# EAGLE design LE910_breakout_0 (EAGLE 7.7.0)
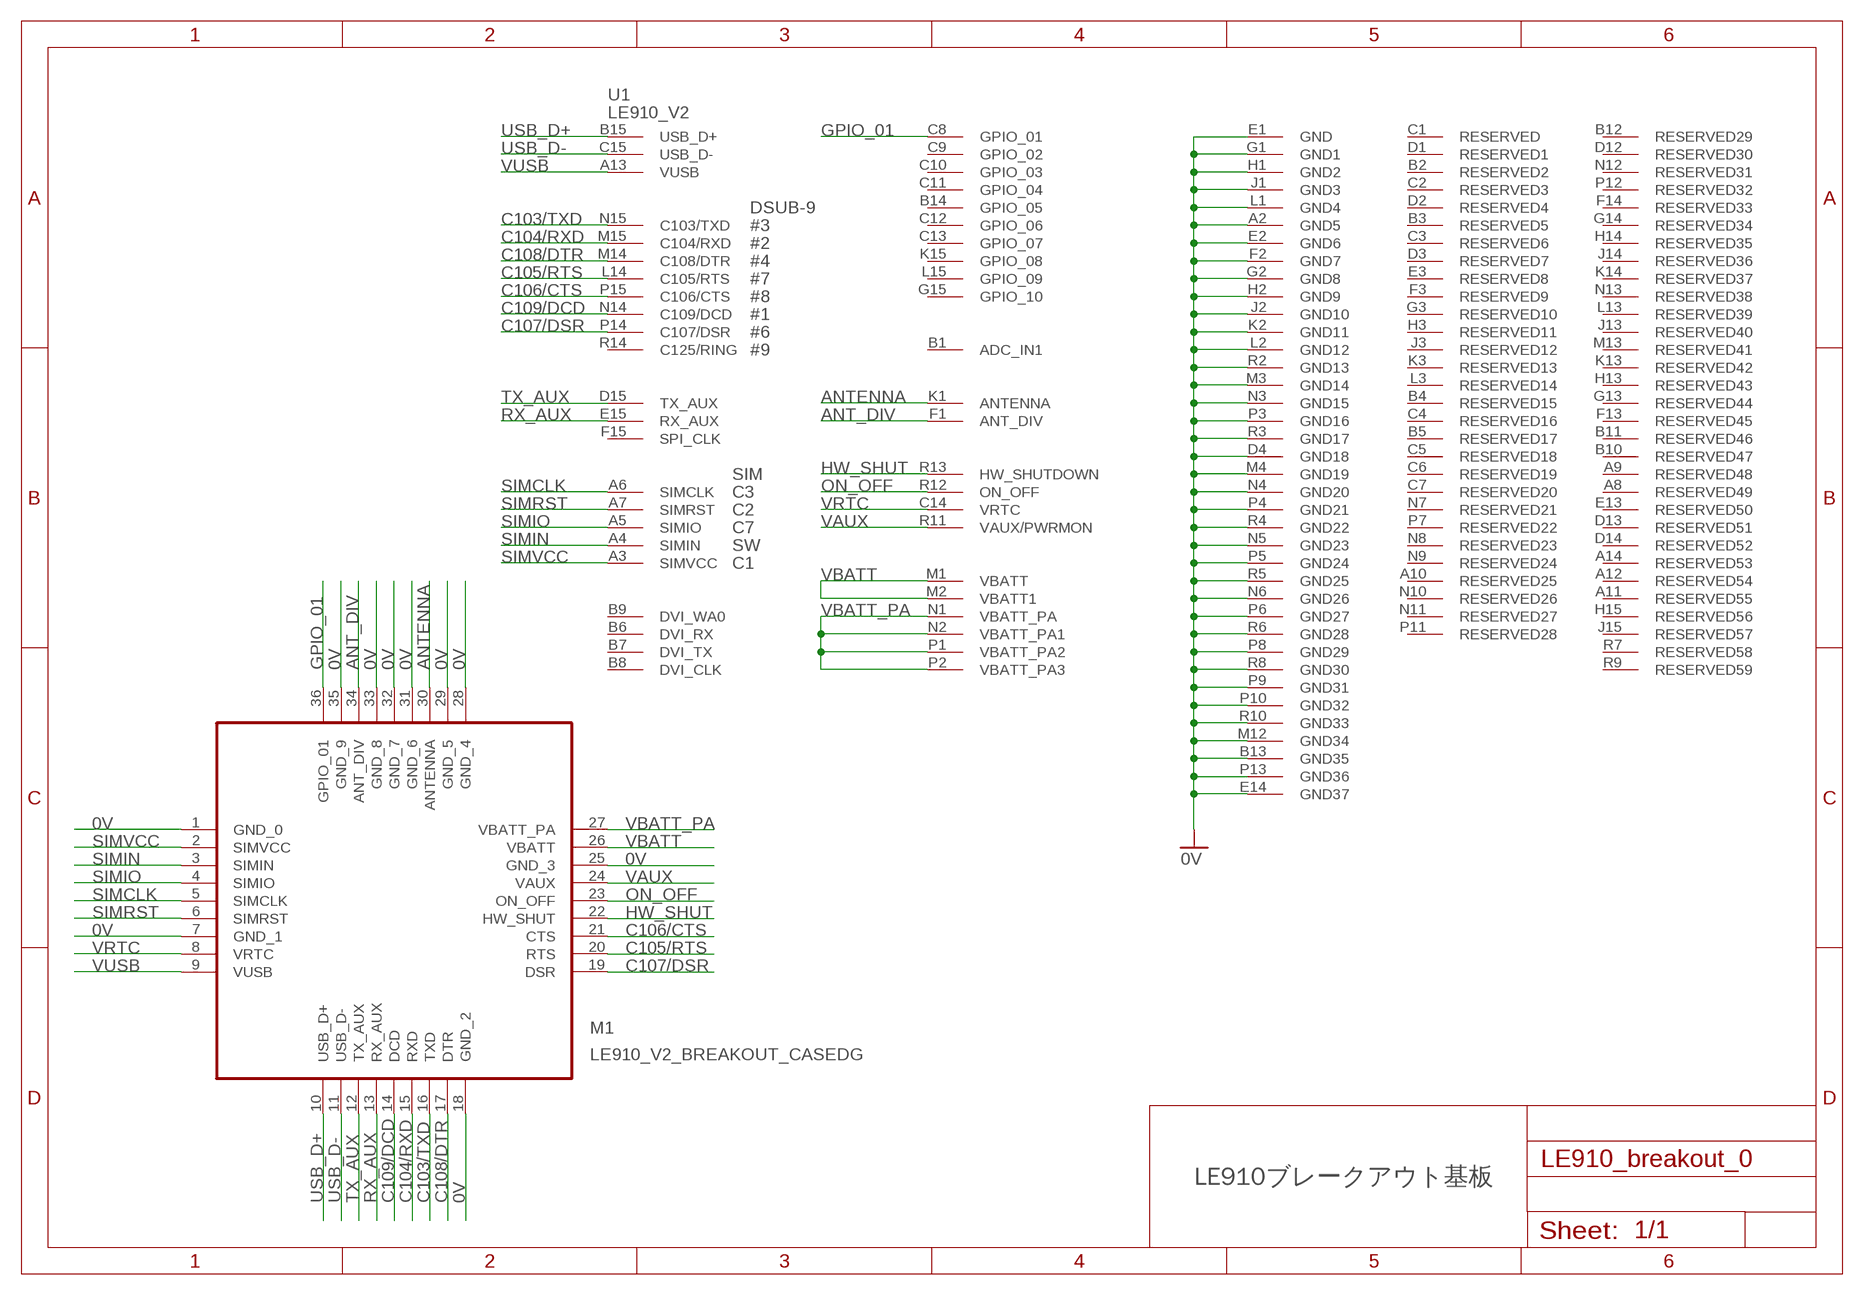
[diagram p0: schematic, sheet 1]

## Parts
M1  LE910_V2_BREAKOUT_CASEDG  [LE910_V2_BREAKOUT_CASEDG]
U1  LE910_V2  [LE910_V2]

## Nets
0V: M1.1(GND_0) M1.7(GND_1) M1.18(GND_2) M1.25(GND_3) M1.28(GND_4) M1.29(GND_5) M1.31(GND_6) M1.32(GND_7) M1.33(GND_8) M1.35(GND_9) U1.A2(GND5) U1.B13(GND35) U1.D4(GND18) U1.E1(GND) U1.E2(GND6) U1.E14(GND37) U1.F2(GND7) U1.G1(GND1) U1.G2(GND8) U1.H1(GND2) U1.H2(GND9) U1.J1(GND3) U1.J2(GND10) U1.K2(GND11) U1.L1(GND4) U1.L2(GND12) U1.M3(GND14) U1.M4(GND19) U1.M12(GND34) U1.N3(GND15) U1.N4(GND20) U1.N5(GND23) U1.N6(GND26) U1.P3(GND16) U1.P4(GND21) U1.P5(GND24) U1.P6(GND27) U1.P8(GND29) U1.P9(GND31) U1.P10(GND32) U1.P13(GND36) U1.R2(GND13) U1.R3(GND17) U1.R4(GND22) U1.R5(GND25) U1.R6(GND28) U1.R8(GND30) U1.R10(GND33)
ANT_DIV: M1.34(ANT_DIV) U1.F1(ANT_DIV)
ANTENNA: M1.30(ANTENNA) U1.K1(ANTENNA)
C103/TXD: M1.16(TXD) U1.N15(C103/TXD)
C104/RXD: M1.15(RXD) U1.M15(C104/RXD)
C105/RTS: M1.20(RTS) U1.L14(C105/RTS)
C106/CTS: M1.21(CTS) U1.P15(C106/CTS)
C107/DSR: M1.19(DSR) U1.P14(C107/DSR)
C108/DTR: M1.17(DTR) U1.M14(C108/DTR)
C109/DCD: M1.14(DCD) U1.N14(C109/DCD)
GPIO_01: M1.36(GPIO_01) U1.C8(GPIO_01)
HW_SHUT: M1.22(HW_SHUT) U1.R13(HW_SHUTDOWN)
ON_OFF: M1.23(ON_OFF) U1.R12(ON_OFF)
RX_AUX: M1.13(RX_AUX) U1.E15(RX_AUX)
SIMCLK: M1.5(SIMCLK) U1.A6(SIMCLK)
SIMIN: M1.3(SIMIN) U1.A4(SIMIN)
SIMIO: M1.4(SIMIO) U1.A5(SIMIO)
SIMRST: M1.6(SIMRST) U1.A7(SIMRST)
SIMVCC: M1.2(SIMVCC) U1.A3(SIMVCC)
TX_AUX: M1.12(TX_AUX) U1.D15(TX_AUX)
USB_D+: M1.10(USB_D+) U1.B15(USB_D+)
USB_D-: M1.11(USB_D-) U1.C15(USB_D-)
VAUX: M1.24(VAUX) U1.R11(VAUX/PWRMON)
VBATT: M1.26(VBATT) U1.M1(VBATT) U1.M2(VBATT1)
VBATT_PA: M1.27(VBATT_PA) U1.N1(VBATT_PA) U1.N2(VBATT_PA1) U1.P1(VBATT_PA2) U1.P2(VBATT_PA3)
VRTC: M1.8(VRTC) U1.C14(VRTC)
VUSB: M1.9(VUSB) U1.A13(VUSB)
Unconnected: U1.A8(RESERVED49) U1.A9(RESERVED48) U1.A10(RESERVED25) U1.A11(RESERVED55) U1.A12(RESERVED54) U1.A14(RESERVED53) U1.B1(ADC_IN1) U1.B2(RESERVED2) U1.B3(RESERVED5) U1.B4(RESERVED15) U1.B5(RESERVED17) U1.B6(DVI_RX) U1.B7(DVI_TX) U1.B8(DVI_CLK) U1.B9(DVI_WA0) U1.B10(RESERVED47) U1.B11(RESERVED46) U1.B12(RESERVED29) U1.B14(GPIO_05) U1.C1(RESERVED) U1.C2(RESERVED3) U1.C3(RESERVED6) U1.C4(RESERVED16) U1.C5(RESERVED18) U1.C6(RESERVED19) U1.C7(RESERVED20) U1.C9(GPIO_02) U1.C10(GPIO_03) U1.C11(GPIO_04) U1.C12(GPIO_06) U1.C13(GPIO_07) U1.D1(RESERVED1) U1.D2(RESERVED4) U1.D3(RESERVED7) U1.D12(RESERVED30) U1.D13(RESERVED51) U1.D14(RESERVED52) U1.E3(RESERVED8) U1.E13(RESERVED50) U1.F3(RESERVED9) U1.F13(RESERVED45) U1.F14(RESERVED33) U1.F15(SPI_CLK) U1.G3(RESERVED10) U1.G13(RESERVED44) U1.G14(RESERVED34) U1.G15(GPIO_10) U1.H3(RESERVED11) U1.H13(RESERVED43) U1.H14(RESERVED35) U1.H15(RESERVED56) U1.J3(RESERVED12) U1.J13(RESERVED40) U1.J14(RESERVED36) U1.J15(RESERVED57) U1.K3(RESERVED13) U1.K13(RESERVED42) U1.K14(RESERVED37) U1.K15(GPIO_08) U1.L3(RESERVED14) U1.L13(RESERVED39) U1.L15(GPIO_09) U1.M13(RESERVED41) U1.N7(RESERVED21) U1.N8(RESERVED23) U1.N9(RESERVED24) U1.N10(RESERVED26) U1.N11(RESERVED27) U1.N12(RESERVED31) U1.N13(RESERVED38) U1.P7(RESERVED22) U1.P11(RESERVED28) U1.P12(RESERVED32) U1.R7(RESERVED58) U1.R9(RESERVED59) U1.R14(C125/RING)

## Notes on the sheet
- DSUB-9
- #3
- #2
- #4
- #7
- #8
- #1
- #6
- #9
- SIM
- C3
- C2
- C7
- SW
- C1
- LE910ブレークアウト基板

## Library data of the parts
M1 = Modules:LE910_V2_BREAKOUT: LE910-V2ブレークアウト基板 最小構成用インターフェース
U1 = Modules:LE910_V2: Cellular module

## Board
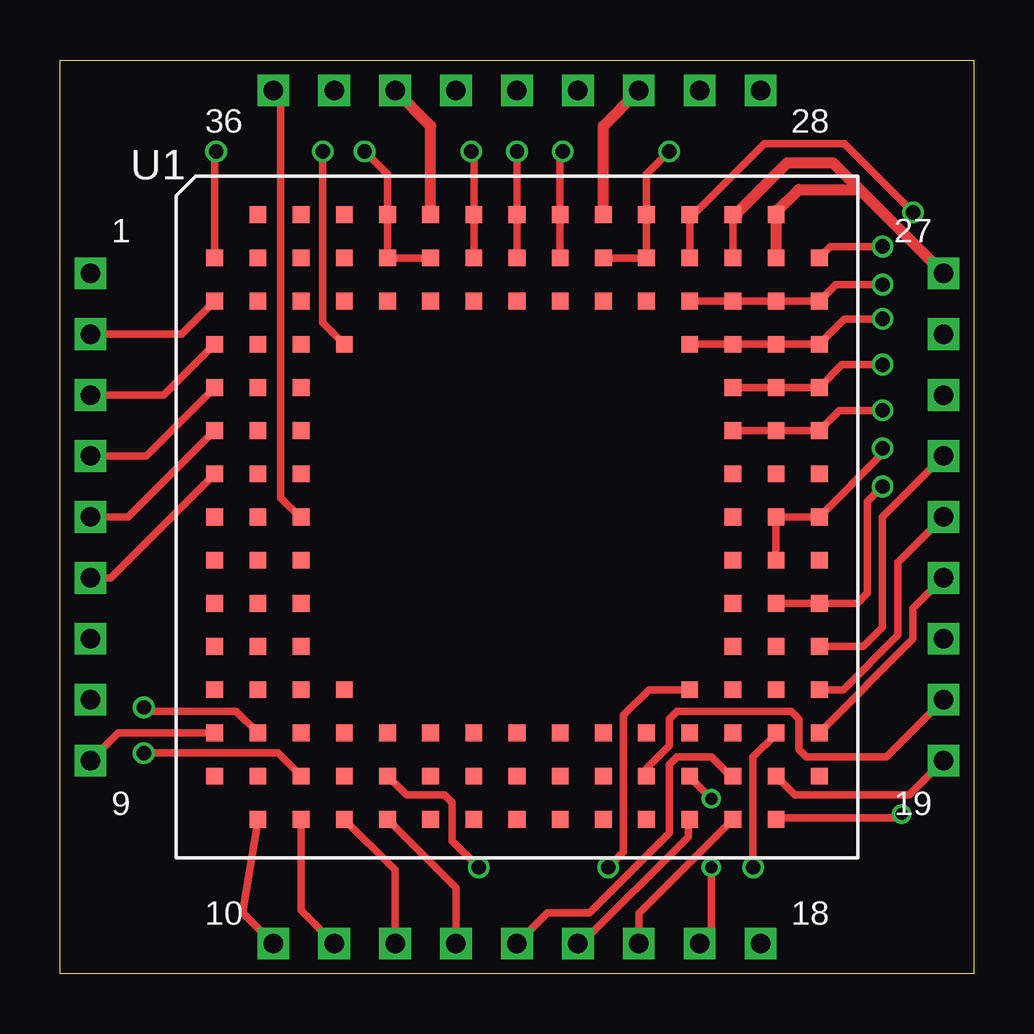
[diagram p1: board, top side]
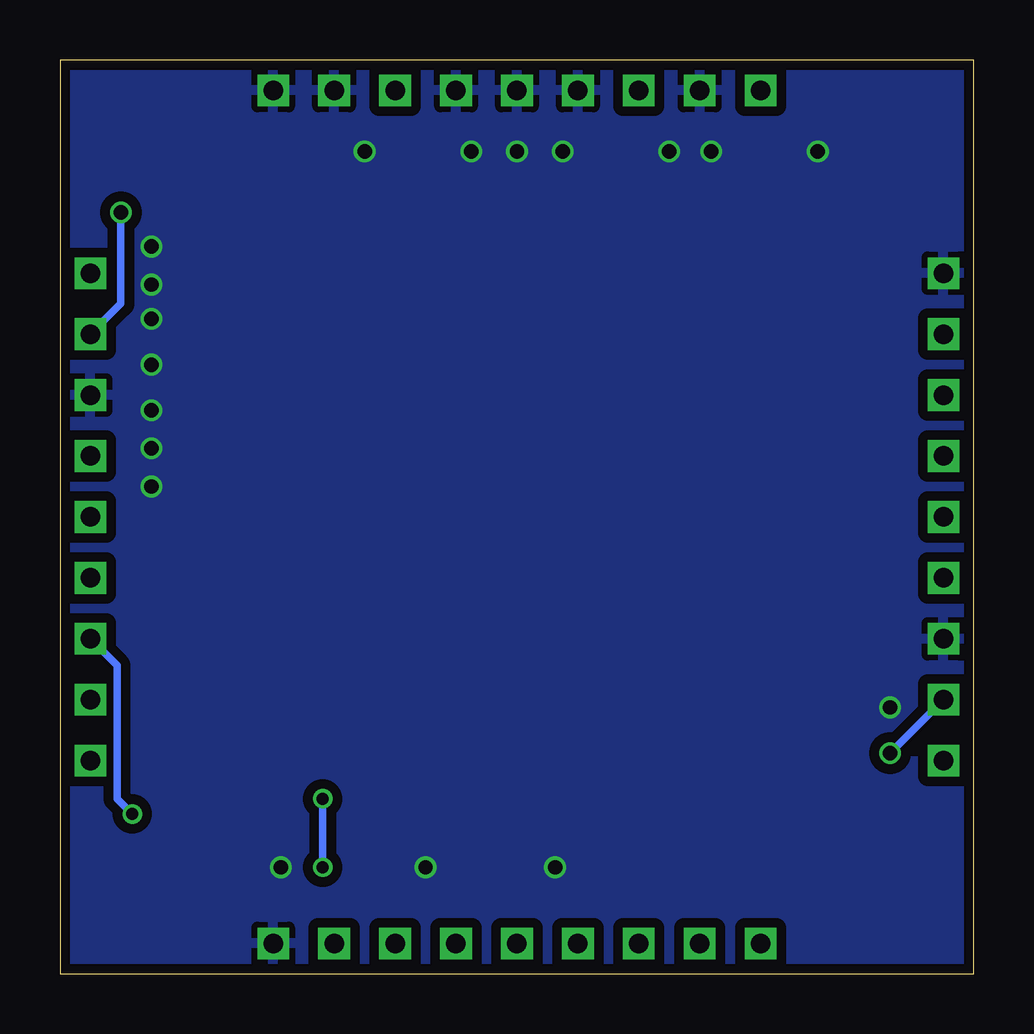
[diagram p2: board, bottom side, seen from below]

Size 38.1 x 38.1 mm. Coordinates in mm from the lower left corner, seen from the top.
Outline: 0,0 0,38.1 38.1,38.1 38.1,0 0,0
Copper layers (1*16): Top 0.035mm / dielectric 1.5mm / Bottom 0.035mm
Design rules "SeeedStudio_2layer_DRU_no_angle_20140221": minimum track width 6mil, minimum drill 12mil, track to track 6mil, track to pad 6mil, pad to pad 6mil, via to via 6mil, smd to smd 0mil, copper to edge 10mil, drill to drill 10mil, minimum pad ring 10mil, minimum via ring 6mil, stop-mask expansion 2mil, vias tented up to drill 100mil, thermal gap 10mil

### Footprints (pad centres in the part's own frame; a part is rotated, then mirrored left to right if it is on the bottom)
LE910_V2_BREAKOUT_CASEDG = drill 0.813 pad 1.27 square: 1 0,27.94; 2 0,25.4; 3 0,22.86; 4 0,20.32; 5 0,17.78; 6 0,15.24; 7 0,12.7; 8 0,10.16; 9 0,7.62; 10 7.62,0; 11 10.16,0; 12 12.7,0; 13 15.24,0; 14 17.78,0; 15 20.32,0; 16 22.86,0; 17 25.4,0; 18 27.94,0; 19 35.56,7.62; 20 35.56,10.16; 21 35.56,12.7; 22 35.56,15.24; 23 35.56,17.78; 24 35.56,20.32; 25 35.56,22.86; 26 35.56,25.4; 27 35.56,27.94; 28 27.94,35.56; 29 25.4,35.56; 30 22.86,35.56; 31 20.32,35.56; 32 17.78,35.56; 33 15.24,35.56; 34 12.7,35.56; 35 10.16,35.56; 36 7.62,35.56
LE910_V2 = smd 0.7 x 0.7: A2 -12.6,10.8; A3 -12.6,9; A4 -12.6,7.2; A5 -12.6,5.4; A6 -12.6,3.6; A7 -12.6,1.8; A8 -12.6,0; A9 -12.6,-1.8; A10 -12.6,-3.6; A11 -12.6,-5.4; A12 -12.6,-7.2; A13 -12.6,-9; A14 -12.6,-10.8; B1 -10.8,12.6; B2 -10.8,10.8; B3 -10.8,9; B4 -10.8,7.2; B5 -10.8,5.4; B6 -10.8,3.6; B7 -10.8,1.8; B8 -10.8,0; B9 -10.8,-1.8; B10 -10.8,-3.6; B11 -10.8,-5.4; B12 -10.8,-7.2; B13 -10.8,-9; B14 -10.8,-10.8; B15 -10.8,-12.6; C1 -9,12.6; C2 -9,10.8; C3 -9,9; C4 -9,7.2; C5 -9,5.4; C6 -9,3.6; C7 -9,1.8; C8 -9,0; C9 -9,-1.8; C10 -9,-3.6; C11 -9,-5.4; C12 -9,-7.2; C13 -9,-9; C14 -9,-10.8; C15 -9,-12.6; D1 -7.2,12.6; D2 -7.2,10.8; D3 -7.2,9; D4 -7.2,7.2; D12 -7.2,-7.2; D13 -7.2,-9; D14 -7.2,-10.8; D15 -7.2,-12.6; E1 -5.4,12.6; E2 -5.4,10.8; E3 -5.4,9; E13 -5.4,-9; E14 -5.4,-10.8; E15 -5.4,-12.6; F1 -3.6,12.6; F2 -3.6,10.8; F3 -3.6,9; F13 -3.6,-9; F14 -3.6,-10.8; F15 -3.6,-12.6; G1 -1.8,12.6; G2 -1.8,10.8; G3 -1.8,9; G13 -1.8,-9; G14 -1.8,-10.8; G15 -1.8,-12.6; H1 0,12.6; H2 0,10.8; H3 0,9; H13 0,-9; H14 0,-10.8; H15 0,-12.6; J1 1.8,12.6; J2 1.8,10.8; J3 1.8,9; J13 1.8,-9; J14 1.8,-10.8; J15 1.8,-12.6; K1 3.6,12.6; K2 3.6,10.8; K3 3.6,9; K13 3.6,-9; K14 3.6,-10.8; K15 3.6,-12.6; L1 5.4,12.6; L2 5.4,10.8; L3 5.4,9; L13 5.4,-9; L14 5.4,-10.8; L15 5.4,-12.6; M1 7.2,12.6; M2 7.2,10.8; M3 7.2,9; M4 7.2,7.2; M12 7.2,-7.2; M13 7.2,-9; M14 7.2,-10.8; M15 7.2,-12.6; N1 9,12.6; N2 9,10.8; N3 9,9; N4 9,7.2; N5 9,5.4; N6 9,3.6; N7 9,1.8; N8 9,0; N9 9,-1.8; N10 9,-3.6; N11 9,-5.4; N12 9,-7.2; N13 9,-9; N14 9,-10.8; N15 9,-12.6; P1 10.8,12.6; P2 10.8,10.8; P3 10.8,9; P4 10.8,7.2; P5 10.8,5.4; P6 10.8,3.6; P7 10.8,1.8; P8 10.8,0; P9 10.8,-1.8; P10 10.8,-3.6; P11 10.8,-5.4; P12 10.8,-7.2; P13 10.8,-9; P14 10.8,-10.8; P15 10.8,-12.6; R2 12.6,10.8; R3 12.6,9; R4 12.6,7.2; R5 12.6,5.4; R6 12.6,3.6; R7 12.6,1.8; R8 12.6,0; R9 12.6,-1.8; R10 12.6,-3.6; R11 12.6,-5.4; R12 12.6,-7.2; R13 12.6,-9; R14 12.6,-10.8

### Placement (x,y rotation side)
M1  1.27,1.27 0 top
U1  19.05,19.05 0 top

### Tracks (layer width: path | path; a pad name or v marks a point on that pad's centre or on a via)
0V  (via drill 0.6)
  Top 0.305: U1.D4 10.95,27.15 v10.95,34.29 | 31.59,29.85 U1.R2 32.12,30.32 v34.29,30.32 | U1.M4 U1.N4 U1.P4 U1.R4 32.7,27.3 v34.29,27.3 | U1.R5 U1.P5 U1.N5 | U1.N6 U1.P6 U1.R6 32.49,23.5 v34.29,23.5 | U1.P13 29.8,10.05 29.8,9.95 28.89,9.05 v28.89,4.45 | U1.P9 U1.P8 U1.R8 | U1.R8 31.75,19.05 | U1.M3 U1.N3 U1.P3 U1.R3 32.33,28.73 v34.29,28.73 | U1.R5 | U1.R5 32.6,25.4 v34.29,25.4 | v34.29,20.32 33.66,19.68 33.66,15.88 33.23,15.45 U1.R10 U1.P10 | U1.R8 34.29,21.69 v34.29,21.91 | v17.14,34.29 17.25,34.19 U1.G1 U1.G2 | v20.95,34.29 20.85,34.19 U1.J1 U1.J2 | v19.05,34.29 U1.H1 U1.H2 | v25.4,34.29 24.45,33.34 U1.L1 U1.L2 U1.K2 | v12.7,34.29 13.65,33.34 U1.E1 U1.E2 U1.F2 | U1.B13 7.35,10.95 3.65,10.95 v3.49,11.11 | U1.E14 14.45,7.46 16.03,7.46 16.35,7.14 16.35,5.56 v17.46,4.45 | U1.A2 6.45,34.23 v6.51,34.29 | U1.M12 24.55,11.85 23.5,10.79 23.5,5.08 v22.86,4.45
  pour Bottom (isolate 0.406): -1.27,-1.27 -1.27,39.37 39.37,39.37 39.37,-1.27
ANT_DIV
  Top 0.457: U1.F1 15.45,35.35 M1.34
ANTENNA
  Top 0.457: U1.K1 22.65,35.35 M1.30
C103/TXD
  Top 0.305: M1.16 24.13,2.53 U1.N15
C104/RXD
  Top 0.305: M1.15 21.75,1.27 26.19,5.71 26.19,6.39 U1.M15
C105/RTS
  Top 0.305: U1.L14 24.45,8.57 25.4,9.53 25.4,10.64 25.72,10.95 30.48,10.95 30.8,10.64 30.8,9.37 31.11,9.05 34.45,9.05 M1.20
C106/CTS  (via drill 0.5)
  Top 0.305: U1.P15 29.95,6.45 30,6.51 34.92,6.51 v35.08,6.67
  Bottom 0.305: v35.08,6.67 35.72,7.3 35.72,12.86 M1.21
C107/DSR
  Top 0.305: U1.P14 30.64,7.46 35.4,7.46 M1.19
C108/DTR  (via drill 0.5)
  Top 0.305: U1.M14 26.25,8.15 26.3,8.15 v27.15,7.3 | v27.15,4.45 27.15,1.75 M1.17
  Bottom 0.305: v27.15,7.3 v27.15,4.45
C109/DCD
  Top 0.305: U1.N14 28.05,8.21 27.99,8.21 27.15,9.05 25.72,9.05 25.4,8.73 25.4,5.87 22.07,2.54 20.32,2.54 M1.14
GPIO_01
  Top 0.305: U1.C8 10,19.05 9.21,19.84 9.21,36.51 M1.36
HW_SHUT
  Top 0.305: M1.22 35.56,15.24 35.56,13.96 U1.R13
ON_OFF
  Top 0.305: M1.23 34.92,17.14 34.92,14.13 32.65,11.85 U1.R12
RX_AUX
  Top 0.305: M1.13 16.51,3.59 U1.E15
SIMCLK
  Top 0.305: M1.5 2.85,19.05 U1.A6
SIMIN
  Top 0.305: M1.3 4.33,24.13 U1.A4
SIMIO
  Top 0.305: M1.4 3.59,21.59 U1.A5
SIMRST
  Top 0.305: M1.6 2.11,16.51 U1.A7
SIMVCC
  Top 0.305: M1.2 5.07,26.67 U1.A3
TX_AUX
  Top 0.305: M1.12 13.97,4.33 U1.D15
USB_D+
  Top 0.305: U1.B15 7.62,2.54 M1.10
USB_D-
  Top 0.305: U1.C15 10.05,2.65 M1.11
VAUX
  Top 0.305: M1.24 34.29,19.05 34.29,14.45 33.49,13.65 U1.R11
VBATT  (via drill 0.6)
  Top 0.305: U1.M2 U1.M1 26.41,31.65 29.37,34.61 32.7,34.61 v35.56,31.75
  Bottom 0.305: v35.56,31.75 35.56,27.94 M1.26
VBATT_PA
  Top 0.305: U1.N2 U1.N1
  Top 0.457: U1.P1 U1.P2 | 28.16,31.65 30.32,33.81 32.23,33.81 33.34,32.7 | 29.85,31.75 30.8,32.7 33.34,32.7 | M1.27 33.34,32.7
  Top 0.61: U1.N1 28.16,31.65 | U1.P1 29.85,31.75
VRTC  (via drill 0.6)
  Top 0.305: U1.C14 9.09,9.21 v3.49,9.21
  Bottom 0.305: v3.49,9.21 M1.8
VUSB
  Top 0.305: U1.A13 2.43,10.05 M1.9